# Altium project sdl_main_adapter.PrjPcb
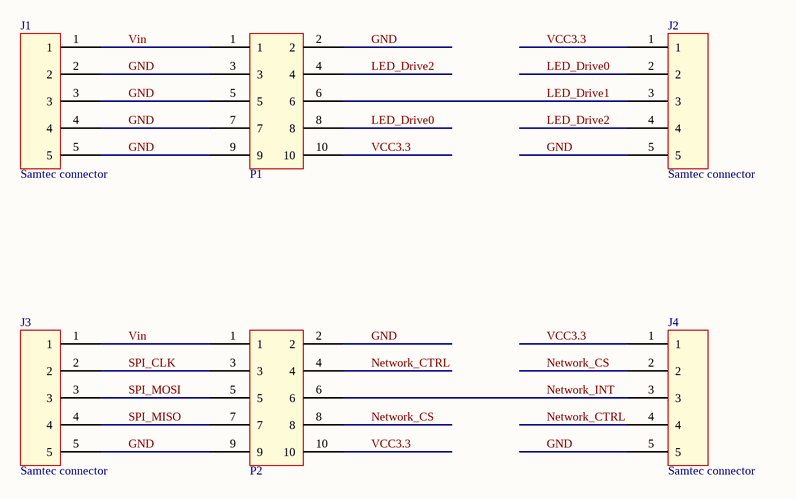
[diagram p0: sdl_adapter.SchDoc]
1 sheet, 6 parts. Net scope: global (net labels, ports and power ports of the same name join across sheets).
Board file: sdl_adapter.PcbDoc

## Sheet sdl_adapter.SchDoc
size A

### Parts
J1  Samtec connector  [TFM-105-02-L-S]
J2  Samtec connector  [TFM-105-02-L-S]
J3  Samtec connector  [TFM-105-02-L-S]
J4  Samtec connector  [TFM-105-02-L-S]
P1  2 x 5 header SMD  [2x5 header SMD]  (value not drawn)
P2  2 x 5 header SMD  [2x5 header SMD]  (value not drawn)

### Nets
GND: J1.2 J1.3 J1.4 J1.5 J2.5 J3.5 J4.5 P1.2 P1.3 P1.5 P1.7 P1.9 P2.2 P2.9
LED_Drive0: J2.2 P1.8
LED_Drive1: J2.3 P1.6
LED_Drive2: J2.4 P1.4
Network_CS: J4.2 P2.8
Network_CTRL: J4.4 P2.4
Network_INT: J4.3 P2.6
SPI_CLK: J3.2 P2.3
SPI_MISO: J3.4 P2.7
SPI_MOSI: J3.3 P2.5
VCC3.3: J2.1 J4.1 P1.10 P2.10
Vin: J1.1 J3.1 P1.1 P2.1

### Library data of the parts
J1-J4 = Samtec conntector: Samtec connector, 1.27 mm, single row, 5 pos SMD; Supplier 1: Samtec
P1 P2 = 2 x 5 header SMD: 2x5 100 mil header SMD; Supplier 1: Digi-Key; Supplier Part Number 1: 609-4723-ND